# Altium schematic sheet Top.SchDoc
size A4; SheetNumber: 1; SheetTotal: 3
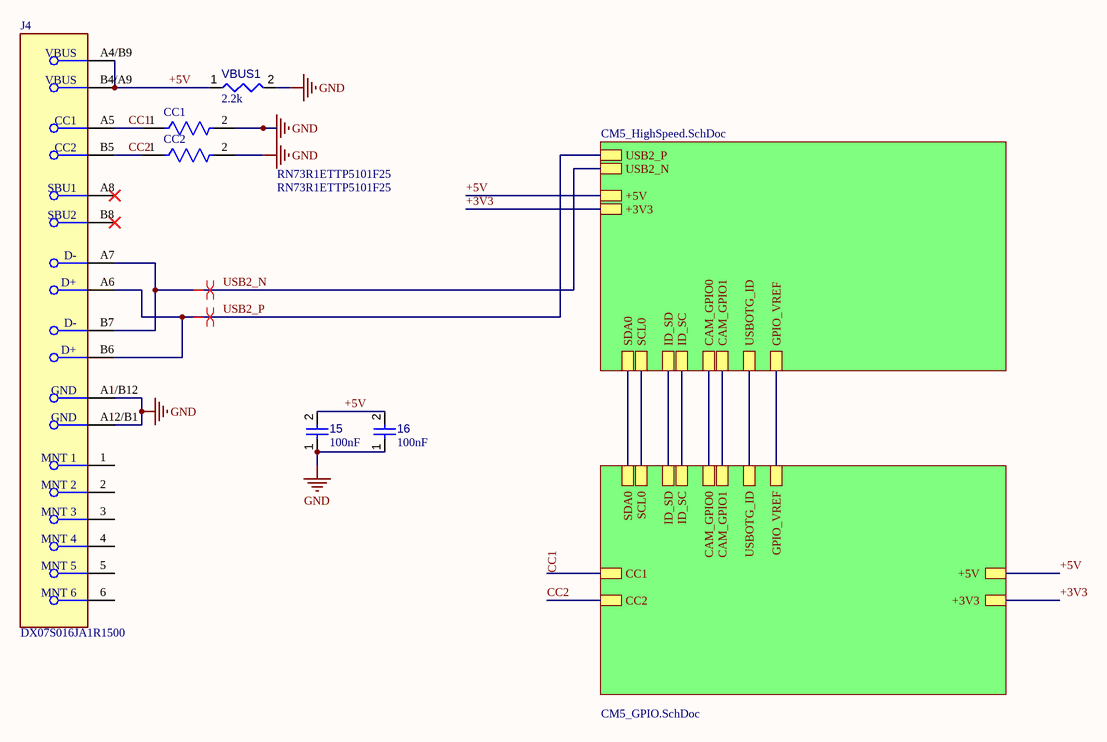
[diagram p0: Top.SchDoc]

## Parts
15  value 100nF  [CAPC0402(1005)60_L]  (hidden comment: Capacitor 100nF +/-20% 50V 0402)
16  value 100nF  [CAPC0402(1005)60_L]  (hidden comment: Capacitor 100nF +/-20% 50V 0402)
CC1  RN73R1ETTP5101F25  [FP-RN73R1E-IPC_C]
CC2  RN73R1ETTP5101F25  [FP-RN73R1E-IPC_C]
J4  DX07S016JA1R1500  [FP-DX07S016JA1R1500-MFG]
VBUS1  value 2.2k  [RESC0402(1005)_L]  (hidden comment: 2D2KR2J)

## Sub-sheets
? = CM5_GPIO.SchDoc: SDA0, SCL0, ID_SD, ID_SC, CAM_GPIO0, CAM_GPIO1, USBOTG_ID, GPIO_VREF, +5V, +3V3, CC1, CC2
? = CM5_HighSpeed.SchDoc: USB2_P, USB2_N, +5V, +3V3, SDA0, SCL0, ID_SD, CAM_GPIO0, ID_SC, CAM_GPIO1, USBOTG_ID, GPIO_VREF

## Nets
GND: 15.1 16.1 CC1.2 CC2.2 J4.A1/B12(GND) J4.A12/B1(GND) VBUS1.2
+3V3: sheet /+3V3, sheet /+3V3
+5V: 15.2 16.2 J4.A4/B9(VBUS) J4.B4/A9(VBUS) VBUS1.1 ; sheet /+5V, sheet /+5V
CC1: CC1.1 J4.A5(CC1) ; sheet /CC1
CC2: CC2.1 J4.B5(CC2) ; sheet /CC2
USB2_N: J4.A7(D-) J4.B7(D-) ; sheet /USB2_N
USB2_P: J4.A6(D+) J4.B6(D+) ; sheet /USB2_P
(unnamed): sheet /SDA0, sheet /SDA0
(unnamed): sheet /SCL0, sheet /SCL0
(unnamed): sheet /ID_SD, sheet /ID_SD
(unnamed): sheet /ID_SC, sheet /ID_SC
(unnamed): sheet /CAM_GPIO0, sheet /CAM_GPIO0
(unnamed): sheet /CAM_GPIO1, sheet /CAM_GPIO1
(unnamed): sheet /USBOTG_ID, sheet /USBOTG_ID
(unnamed): sheet /GPIO_VREF, sheet /GPIO_VREF

Not connected (* = marked no-connect by the designer): J4 1(MNT_1) 2(MNT_2) 3(MNT_3) 4(MNT_4) 5(MNT_5) 6(MNT_6) A8(SBU1)* B8(SBU2)*

## Layout directives
differential pair: USB2_N, USB2_P

## Library data of the parts
15 16 = CMP-001-00067-3: Chip Capacitor, 100nF +/-20%, 50V, 0402, Thickness 0.6 mm; Tolerance: 10%; Min Operating Temperature: -55°C; Pins: 2; Case/Package: 0402; Max Operating Temperature: 85°C; Voltage Rating: 50V; Mounting Technology: SMT
CC1 CC2 = CMP-04015-008529-1: 5.1kΩ ±1% 0.063W, 1/16W Chip Resistor 0402 (1005 Metric) Moisture Resistant Thin Film
J4 = CMP-19038-000003-1: CONN RCP USB2.0 TYP C 24P SMD RA
VBUS1 = CMP-009-00087-2: 2K2 0.063W 5% 0402 (1005 Metric)  SMD; Power: 63mW; Mounting Technology: SMT; Tolerance: 5%; Case/Package: 0402; Pins: 2